# EAGLE schematic smart-gateway (EAGLE 7.3.0)
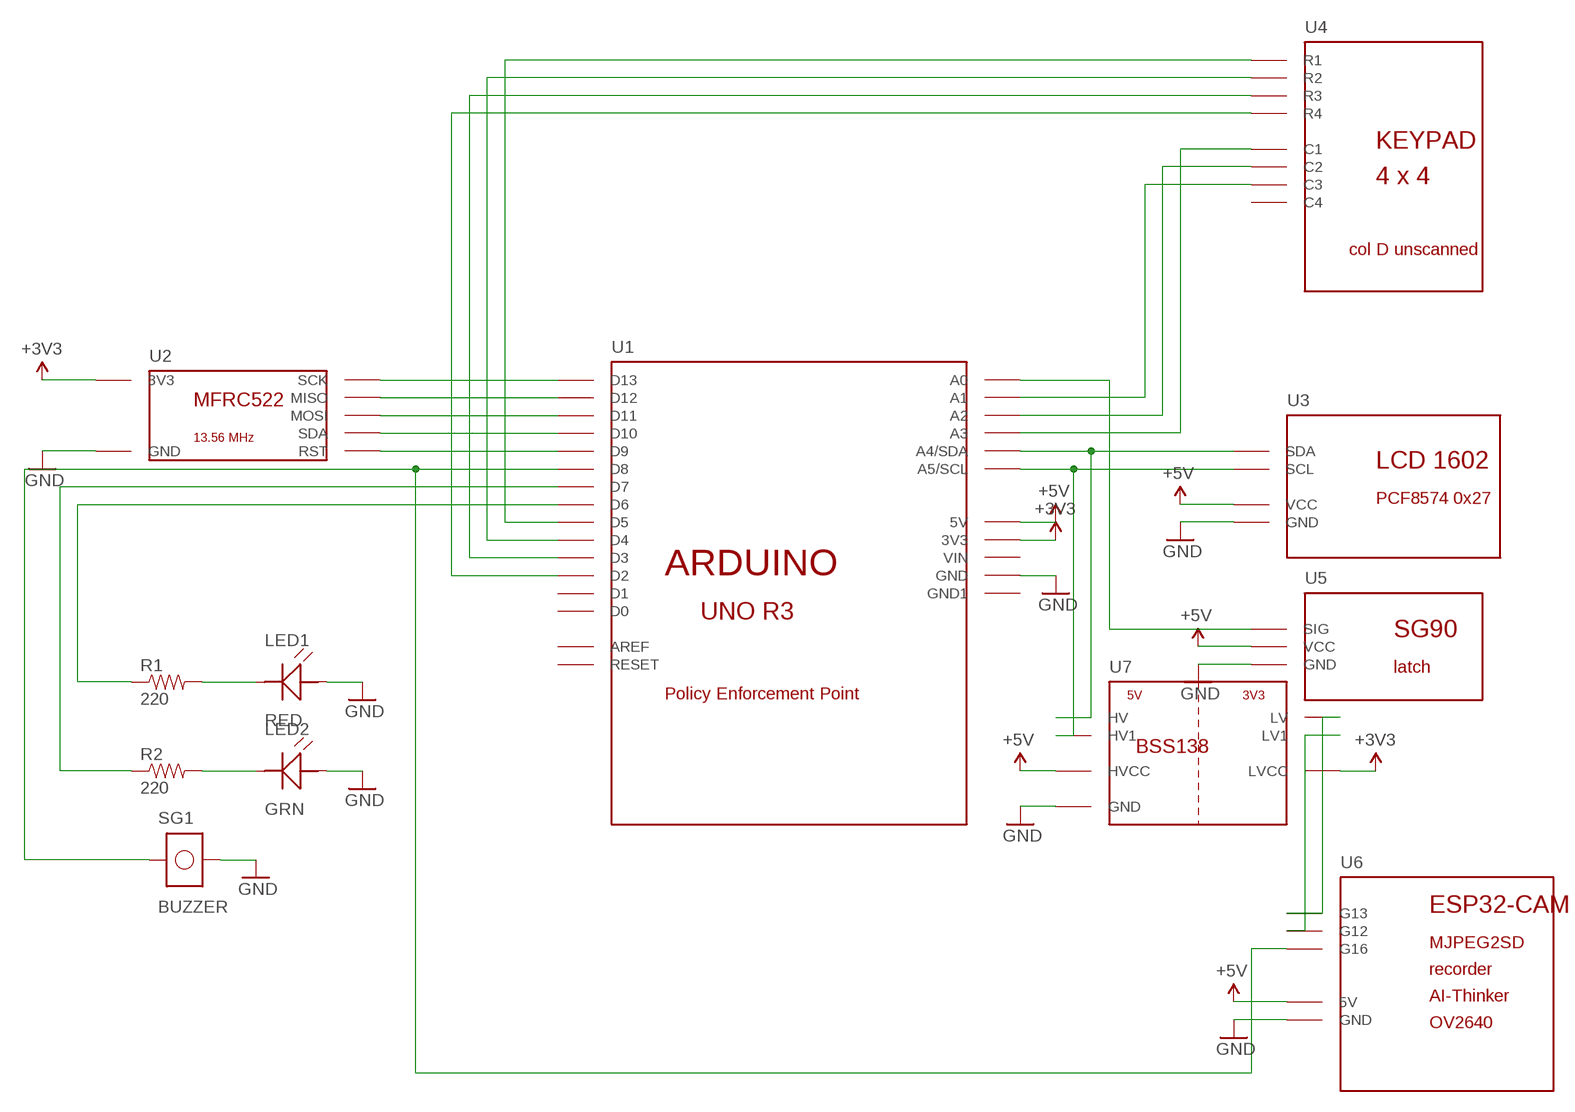
[diagram p0: schematic, sheet 1]

## Parts
LED1  RED  LED  (no package)
LED2  GRN  LED  (no package)
R1  220  RESISTOR  (no package)
R2  220  RESISTOR  (no package)
SG1  BUZZER  (no package)
U1  ARDUINO_UNO  (no package)
U2  MFRC522  (no package)
U3  LCD1602_I2C  (no package)
U4  KEYPAD4X4  (no package)
U5  SERVO  (no package)
U6  ESP32CAM  (no package)
U7  LVLSHIFT  (no package)

## Nets
+3V3: U1.3V3 U2.3V3 U7.LVCC ; supply symbol labelled V3V3
+5V: U1.5V U3.VCC U5.VCC U6.5V U7.HVCC ; supply symbol labelled VCC5
A0: U1.A0 U5.SIG
A1: U1.A1 U4.C3
A2: U1.A2 U4.C2
A3: U1.A3 U4.C1
A4/SDA: U1.A4/SDA U3.SDA U7.HV
A5/SCL: U1.A5/SCL U3.SCL U7.HV1
CAM_SCL: U6.G12 U7.LV1
CAM_SDA: U6.G13 U7.LV
D2: U1.D2 U4.R4
D3: U1.D3 U4.R3
D4: U1.D4 U4.R2
D5: U1.D5 U4.R1
D6: R1.1 U1.D6
D7: R2.1 U1.D7
D8: SG1.1 U1.D8 U6.G16
D9: U1.D9 U2.RST
D10: U1.D10 U2.SDA
D11: U1.D11 U2.MOSI
D12: U1.D12 U2.MISO
D13: U1.D13 U2.SCK
GND: LED1.C LED2.C SG1.2 U1.GND U2.GND U3.GND U5.GND U6.GND U7.GND
N$1: LED1.A R1.2
N$2: LED2.A R2.2
Unconnected: U1.AREF U1.D0 U1.D1 U1.GND1 U1.RESET U1.VIN U4.C4

## Library data of the parts
LED1 LED2 = smart-gateway:LED
R1 R2 = smart-gateway:RESISTOR
SG1 = smart-gateway:BUZZER
U1 = smart-gateway:ARDUINO_UNO: Arduino UNO R3 - enforcement node (schematic only, no package)
U2 = smart-gateway:MFRC522: RC522 13.56 MHz RFID reader module
U3 = smart-gateway:LCD1602_I2C: 1602 character LCD with PCF8574 I2C backpack
U4 = smart-gateway:KEYPAD4X4: 4x4 matrix membrane keypad
U5 = smart-gateway:SERVO: SG90 micro servo - latch actuator
U6 = smart-gateway:ESP32CAM: ESP32-CAM movement recorder running ESP32-CAM_MJPEG2SD
U7 = smart-gateway:LVLSHIFT: BSS138 bidirectional level shifter, 5 V to 3.3 V